# Altium project LaserLEDController.PrjPcb
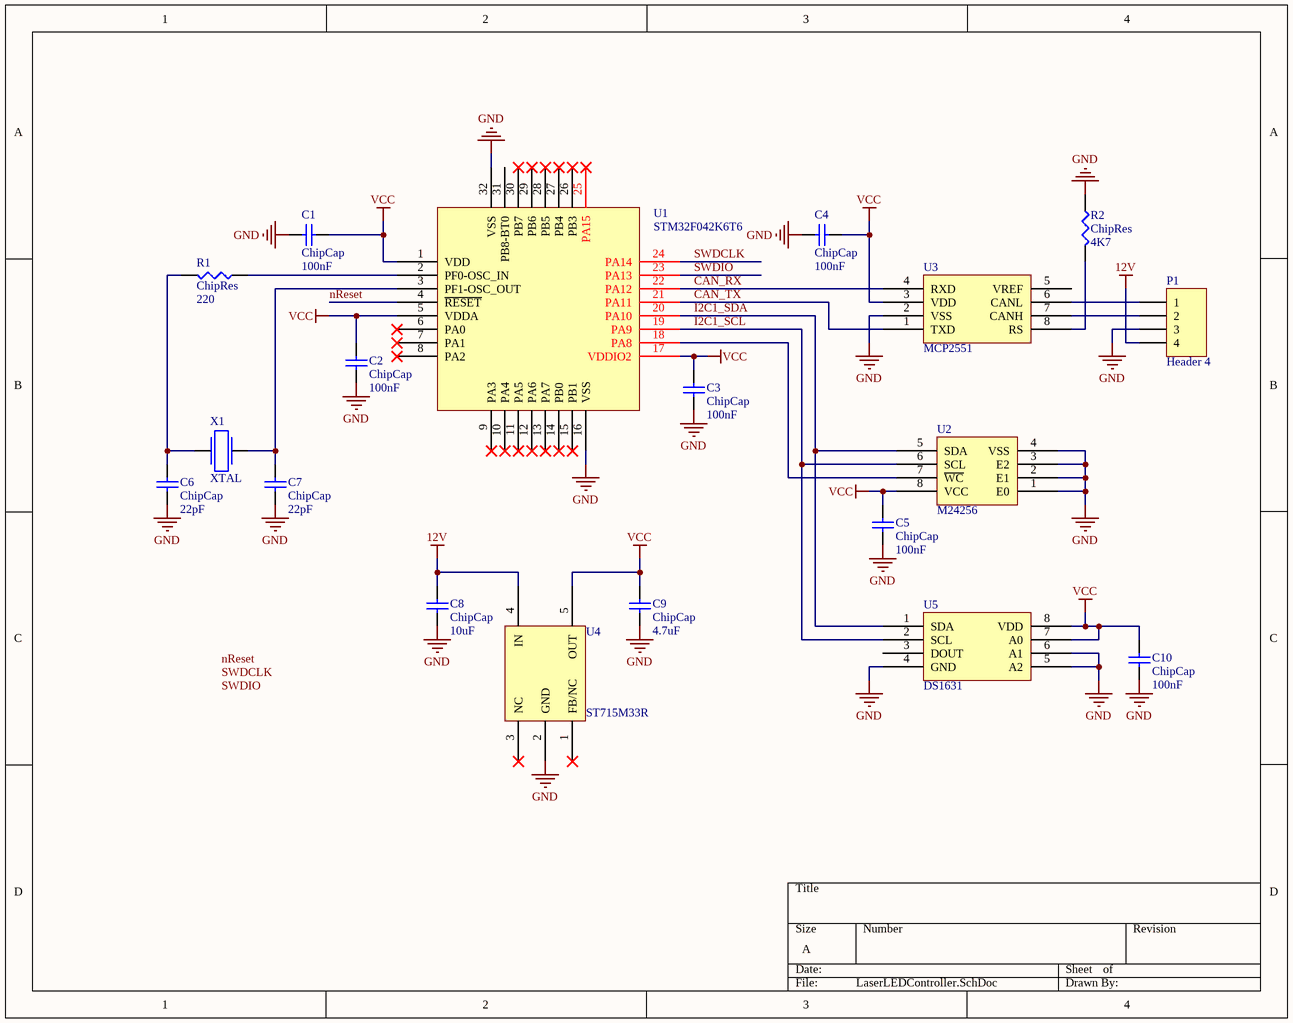
[diagram p0: LaserLEDController.SchDoc]
1 sheet, 19 parts. Net scope: global (net labels, ports and power ports of the same name join across sheets).
Board file: EmitterControllerV2.PcbDoc

## Sheet LaserLEDController.SchDoc
size A

### Parts
C1  ChipCap  value 100nF  [CAP0603]
C2  ChipCap  value 100nF  [CAP0603]
C3  ChipCap  value 100nF  [CAP0603]
C4  ChipCap  value 100nF  [CAP0603]
C5  ChipCap  value 100nF  [CAP0603]
C6  ChipCap  value 22pF  [CAP0603]
C7  ChipCap  value 22pF  [CAP0603]
C8  ChipCap  value 10uF  [CAP0805]
C9  ChipCap  value 4.7uF  [CAP0805]
C10  ChipCap  value 100nF  [CAP0603]
P1  Header 4  [HDR1X4]
R1  ChipRes  value 220  [RES0603]
R2  ChipRes  value 4K7  [RES0603]
U1  STM32F042K6T6  [LQFP32]
U2  M24256  [SOIC8]
U3  MCP2551  [SOIC8]
U4  ST715M33R  [SOT23-5]
U5  DS1631  [SOIC8]
X1  XTAL  [ABM3 Ceramic Crystal]

### Nets
12V: C8.2 P1.4 U4.4(IN)
GND: C1.1 C2.1 C3.1 C4.2 C5.1 C6.1 C7.1 C8.1 C9.1 C10.1 P1.3 R2.1 U1.16(VSS) U1.32(VSS) U2.1(E0) U2.2(E1) U2.3(E2) U2.4(VSS) U3.2(VSS) U4.2(GND) U5.4(GND) U5.5(A2) U5.6(A1)
VCC: C1.2 C2.2 C3.2 C4.1 C5.2 C9.2 C10.2 U1.1(VDD) U1.5(VDDA) U1.17(VDDIO2) U2.8(VCC) U3.3(VDD) U4.5(OUT) U5.7(A0) U5.8(VDD)
CAN_RX: U1.22(PA12) U3.4(RXD)
CAN_TX: U1.21(PA11) U3.1(TXD)
I2C1_SCL: U1.19(PA9) U2.6(SCL) U5.2(SCL)
I2C1_SDA: U1.20(PA10) U2.5(SDA) U5.1(SDA)
nReset: U1.4(~{RESET})
SWDCLK: U1.24(PA14)
SWDIO: U1.23(PA13)
NetC6_2: C6.2 R1.2 X1.1
NetC7_2: C7.2 U1.3(PF1-OSC_OUT) X1.2
NetP1_1: P1.1 U3.6(CANL)
NetP1_2: P1.2 U3.7(CANH)
NetR1_1: R1.1 U1.2(PF0-OSC_IN)
NetR2_2: R2.2 U3.8(RS)
NetU1_18: U1.18(PA8) U2.7(~{WC})

Not connected (* = marked no-connect by the designer): U1 6(PA0)* 7(PA1)* 8(PA2)* 9(PA3)* 10(PA4)* 11(PA5)* 12(PA6)* 13(PA7)* 14(PB0)* 15(PB1)* 25(PA15)* 26(PB3)* 27(PB4)* 28(PB5)* 29(PB6)* 30(PB7)* 31(PB8-BT0); U3 5(VREF); U4 1(FB/NC)* 3(NC)*; U5 3(DOUT)

### Notes on the sheet
- Labels drawn without touching a wire or pin: nReset, SWDCLK, SWDIO

### Library data of the parts
C1-C10 = ChipCap: Capacitor; Published: 8-Jun-2000; LatestRevisionDate: 17-Jul-2002; LatestRevisionNote: Re-released for DXP Platform.; PackageReference: RAD-0.3; Publisher: Altium Limited
P1 = Header 4: Header, 4-Pin; LatestRevisionDate: 17-Jul-2002; LatestRevisionNote: Re-released for DXP Platform.; Publisher: Altium Limited
R1 R2 = ChipRes: Chip resistor
U1 = STM32F042K6T6: ARM Cortex-M0 Microcontroller
U2 = M24256: 256 Kbit I2C EEPROM
U3 = MCP2551-I/SN: CAN Transceiver
U4 = ST715M33R: High input voltage - 85 mA LDO linear regulator
U5 = DS1631: High-Precision Digital  Thermometer and Thermostat
X1 = ABM3 Ceramic SMD Crystal: Quartz crystall oscillator